# Altium schematic sheet Connectors.SchDoc
size A4 portrait; SheetNumber: 2; SheetTotal: 8
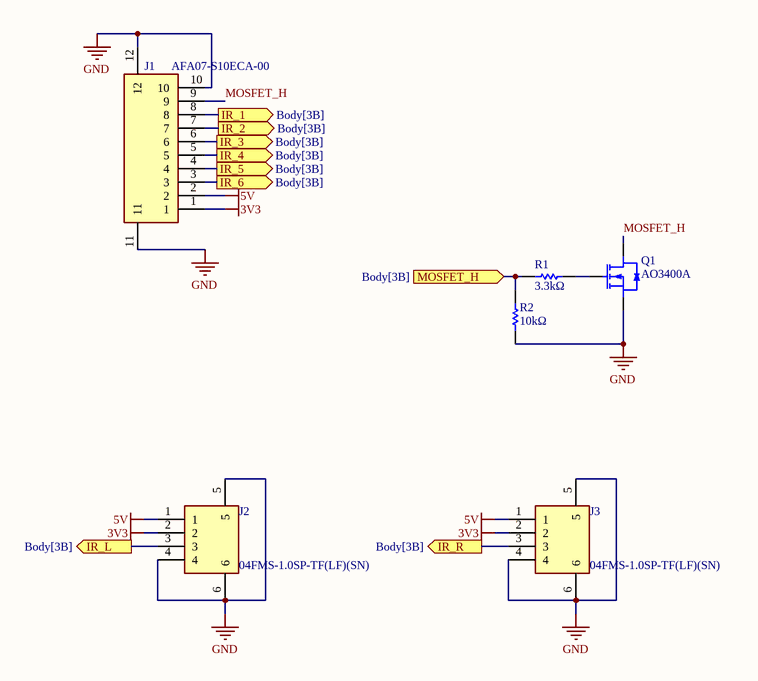
[diagram p0: Connectors.SchDoc]

## Parts
J1  AFA07-S10ECA-00  [FPC-SMD-P1.00-10P_LCS-SJ-H2.5]
J2  04FMS-1.0SP-TF(LF)(SN)  [FPC-SMD-P1.00-4P_JST]
J3  04FMS-1.0SP-TF(LF)(SN)  [FPC-SMD-P1.00-4P_JST]
Q1  AO3400A  [SOT-23]
R1  value 3.3kΩ  [RES0805]  (hidden comment: 0805W8F3301T5E)
R2  value 10kΩ  [RES0805]  (hidden comment: 0805W8F1002T5E)

## Ports
IR_1 (out, see Body[3B]), IR_2 (out, see Body[3B]), IR_3 (out, see Body[3B]), IR_4 (out, see Body[3B]), IR_5 (out, see Body[3B]), IR_6 (out, see Body[3B]), IR_L (out, see Body[3B]), IR_R (out, see Body[3B]), MOSFET_H (in, see Body[3B])

## Nets
3V3: J1.1 J2.2 J3.2
5V: J1.2 J2.1 J3.1
GND: J1.10 J1.11 J1.12 J2.4 J2.5 J2.6 J3.4 J3.5 J3.6 Q1.S R2.1
IR_1: J1.8 ; port IR_1
IR_2: J1.7 ; port IR_2
IR_3: J1.6 ; port IR_3
IR_4: J1.5 ; port IR_4
IR_5: J1.4 ; port IR_5
IR_6: J1.3 ; port IR_6
IR_L: J2.3 ; port IR_L
IR_R: J3.3 ; port IR_R
MOSFET_H: J1.9 Q1.D
MOSFET_H: R1.1 R2.2 ; port MOSFET_H  [a separate net that carries the same name]
NetQ1_G: Q1.G R1.2

## Library data of the parts
J1 = AFA07-S10ECA-00: Drawer Type 10P Contact,Top Horizontal attachment 1mm SMD,P=1mm,Surface Mount，Right Angle FFC, FPC (Flat Flexible) Connector Assemblies ROHS; Manufacturer_Name: JUSHUO; Geometry.Height: 2.50mm; Manufacturer_Part_Number: AFA07-S10ECA-00; Datasheet Link: https://wmsc.lcsc.com/wmsc/upload/file/pdf/v2/lcsc/2304140030_JUSHUO-AFA07-S10ECA-00_C262737.pdf; LCSC: C262737
J2 J3 = 04FMS-1.0SP-TF(LF)(SN): Drawer Type 4P Dual-sided contacts / top and bottom connection Horizontal attachment 1mm SMD,P=1mm,Surface Mount，Right Angle FFC, FPC (Flat Flexible) Connector Assemblies ROHS; Manufacturer_Name: JST; Geometry.Height: 2.80mm; Manufacturer_Part_Number: 04FMS-1.0SP-TF(LF)(SN); LCSC: C265033; ComponentLink1Description: JLCPCB; ComponentLink1URL: https://jlcpcb.com/partdetail/Jst-04FMS_1_0SP_TF_LF_SN/C265033; ComponentLink2Description: Datasheet; ComponentLink2URL: https://www.lcsc.com/datasheet/lcsc_datasheet_1811061308_JST-04FMS-1-0SP-TF-LF-SN_C265033.pdf
Q1 = AO3400A: 30V 5.7A 26.5mΩ@10V,5.7A 1.4W 1.5V@250uA 1PCSNChannel SOT-23-3L MOSFETs ROHS; Manufacturer: Alpha & Omega Semicon; FET Type: N-Channel; Rds On (Max) @ Id, Vgs: 38 mohm @ 5.7A, 10V; Input Capacitance (Ciss) (Max) @Vds: 630pF; Vgs(th) (Max) Id: 1.5V, Id =250uA; Gate Charge (Qg) (Max) @ Vgs: 7nC @ 4.5V; Vgs (Max): 12 V; Rise / Fall Time (Typ): 2.5 ~ 2.0 (ns); Part Number: AO3400A; Package / Case: SOT-23; Operating Temperature: -55 °C ~150 °C; Drain to Source Voltage (Vds): 30V; Current - Continuous Drain (Id) @25°C: 5.7A; Power Dissipation (Max): 1.4 W; ComponentLink1Description: Datasheet; ComponentLink1URL: https://jlcpcb.com/partdetail/Alpha_OmegaSemicon-AO3400A/C20917; LCSC: C20917
R1 = 0805W8F3301T5E: 125mW Thick Film Resistors 150V ±100ppm/℃ ±1% 3.3kΩ 0805 Chip Resistor - Surface Mount ROHS; Manufacturer_Name: UNI-ROYAL; Geometry.Height: 0.95mm; Manufacturer_Part_Number: 0805W8F3301T5E; Datasheet Link: https://wmsc.lcsc.com/wmsc/upload/file/pdf/v2/lcsc/2206010045_UNI-ROYAL-Uniroyal-Elec-0805W8F3301T5E_C26010.pdf; LCSC: C26010
R2 = 0805W8F1002T5E: 125mW Thick Film Resistors 150V ±100ppm/℃ ±1% 10kΩ 0805 Chip Resistor - Surface Mount ROHS; Manufacturer_Name: UNI-ROYAL; Geometry.Height: 0.95mm; Manufacturer_Part_Number: 0805W8F1002T5E; Datasheet Link: https://wmsc.lcsc.com/wmsc/upload/file/pdf/v2/lcsc/2206010216_UNI-ROYAL-Uniroyal-Elec-0805W8F1002T5E_C17414.pdf; LCSC: C17414